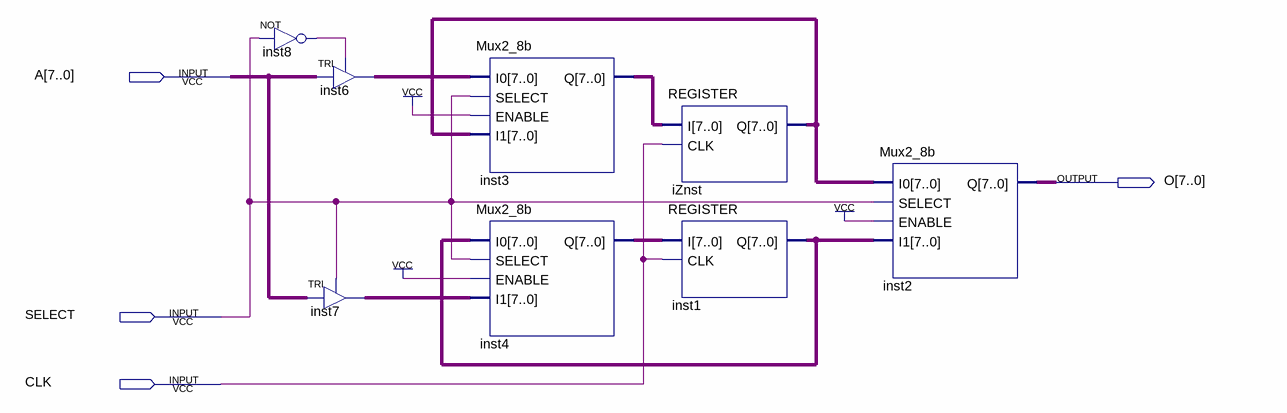
[diagram p0: schematic sheet]
// Quartus schematic RES_MERGED.bdf as structural Verilog: 8 symbols, 4 pins
module RES_MERGED (
  input  [7:0] A,
  input  SELECT,
  input  CLK,
  output [7:0] O
);

  wire inst8_out;
  wire [7:0] inst1_q, inst3_q, inst4_q, inst6_out, inst7_out, iZnst_q;

  not inst8 (inst8_out, SELECT);
  TRI inst6[7:0] (.IN(A), .OE(inst8_out), .OUT(inst6_out));
  TRI inst7[7:0] (.IN(A), .OE(SELECT), .OUT(inst7_out));
  Mux2_8b inst3 (.I0(inst6_out), .SELECT(SELECT), .ENABLE(1'b1), .I1(iZnst_q), .Q(inst3_q));
  Mux2_8b inst4 (.I0(inst1_q), .SELECT(SELECT), .ENABLE(1'b1), .I1(inst7_out), .Q(inst4_q));
  REGISTER iZnst (.I(inst3_q), .CLK(CLK), .Q(iZnst_q));
  REGISTER inst1 (.I(inst4_q), .CLK(CLK), .Q(inst1_q));
  Mux2_8b inst2 (.I0(iZnst_q), .SELECT(SELECT), .ENABLE(1'b1), .I1(inst1_q), .Q(O));
endmodule
